# Altium schematic sheet Sheet.SchDoc
size A4
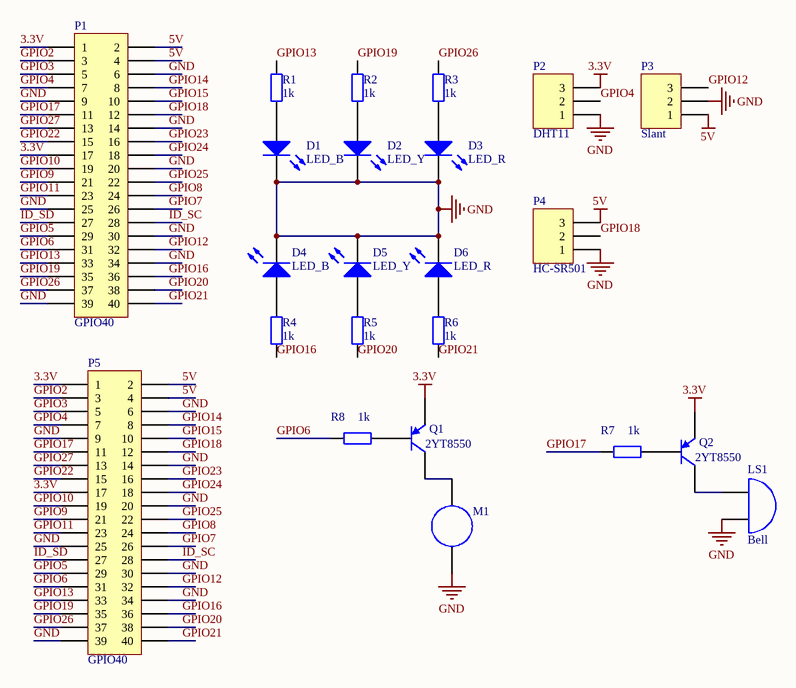
[diagram p0: Sheet.SchDoc]

## Parts
D1  LED_B  [R38]
D2  LED_Y  [R38]
D3  LED_R  [R38]
D4  LED_B  [R38]
D5  LED_Y  [R38]
D6  LED_R  [R38]
LS1  Bell  [BUZZ12]
M1  Meter  [RAD-0.1]  (value not drawn)
P1  GPIO40  [HDR2X20]
P2  DHT11  [HDR1X3]
P3  Slant  [HDR1X3]
P4  HC-SR501  [HDR1X3]
P5  GPIO40  [HDR2X20]
Q1  2YT8550  [SOT-23-3]
Q2  2YT8550  [SOT-23-3]
R1  1k  [R0805]
R2  1k  [R0805]
R3  1k  [R0805]
R4  1k  [R0805]
R5  1k  [R0805]
R6  1k  [R0805]
R7  1k  [R0805]
R8  1k  [R0805]

## Nets
3.3V: P1.1 P1.17 P2.3 P5.1 P5.17 Q1.2(E) Q2.2(E)
5V: P1.2 P1.4 P3.1 P4.3 P5.2 P5.4
GND: D1.2(K) D2.2(K) D3.2(K) D4.2(K) D5.2(K) D6.2(K) LS1.2(B) M1.1 P1.6 P1.9 P1.14 P1.20 P1.25 P1.30 P1.34 P1.39 P2.1 P3.2 P4.1 P5.6 P5.9 P5.14 P5.20 P5.25 P5.30 P5.34 P5.39
GPIO2: P1.3 P5.3
GPIO3: P1.5 P5.5
GPIO4: P1.7 P2.2 P5.7
GPIO5: P1.29 P5.29
GPIO6: P1.31 P5.31 R8.1
GPIO7: P1.26 P5.26
GPIO8: P1.24 P5.24
GPIO9: P1.21 P5.21
GPIO10: P1.19 P5.19
GPIO11: P1.23 P5.23
GPIO12: P1.32 P3.3 P5.32
GPIO13: P1.33 P5.33 R1.2
GPIO14: P1.8 P5.8
GPIO15: P1.10 P5.10
GPIO16: P1.36 P5.36 R4.1
GPIO17: P1.11 P5.11 R7.1
GPIO18: P1.12 P4.2 P5.12
GPIO19: P1.35 P5.35 R2.2
GPIO20: P1.38 P5.38 R5.1
GPIO21: P1.40 P5.40 R6.1
GPIO22: P1.15 P5.15
GPIO23: P1.16 P5.16
GPIO24: P1.18 P5.18
GPIO25: P1.22 P5.22
GPIO26: P1.37 P5.37 R3.2
GPIO27: P1.13 P5.13
ID_SC: P1.28 P5.28
ID_SD: P1.27 P5.27
NetD1_1: D1.1(A) R1.1
NetD2_1: D2.1(A) R2.1
NetD3_1: D3.1(A) R3.1
NetD4_1: D4.1(A) R4.2
NetD5_1: D5.1(A) R5.2
NetD6_1: D6.1(A) R6.2
NetLS1_1: LS1.1(A) Q2.3(C)
NetM1_2: M1.2 Q1.3(C)
NetQ1_1: Q1.1(B) R8.2
NetQ2_1: Q2.1(B) R7.2

## Library data of the parts
D1-D6 = LED0: Typical INFRARED GaAs LED; Published: 8-Jun-2000; LatestRevisionDate: 08-Jul-2005; LatestRevisionNote: Mech Layer 1 removed.; PackageReference: LED-0; Publisher: Altium Limited; PackageDescription: LED; 2 Leads
LS1 = Bell: Electrical Bell; Published: 24-Mar-1999; LatestRevisionDate: 17-Jul-2002; LatestRevisionNote: Re-released for DXP Platform.; PackageReference: PIN2; Publisher: Altium Limited
M1 = Meter: Indicating Instrument; Note: Place a "letter" into the symbol to show the function of the meter or instrument; Published: 24-Mar-1999; LatestRevisionDate: 17-Jul-2002; LatestRevisionNote: Re-released for DXP Platform.; PackageReference: RAD-0.1; Publisher: Altium Limited; PackageDescription: Radial Cap, Thru-Hole; 2 Leads; 0.1 in Pin Spacing
P1 P5 = Header 20X2: Header, 20-Pin, Dual row; LatestRevisionDate: 17-Jul-2002; LatestRevisionNote: Re-released for DXP Platform.; Publisher: Altium Limited
P2-P4 = Header 3: Header, 3-Pin; LatestRevisionDate: 17-Jul-2002; LatestRevisionNote: Re-released for DXP Platform.; Publisher: Altium Limited
R1-R8 = Res2: Resistor 0603 1%; Published: 8-Jun-2000; LatestRevisionDate: 17-Jul-2002; LatestRevisionNote: Re-released for DXP Platform.; PackageReference: AXIAL-0.4; Publisher: Altium Limited; Value: 1K